# EAGLE design bridge (EAGLE 7.7.0)
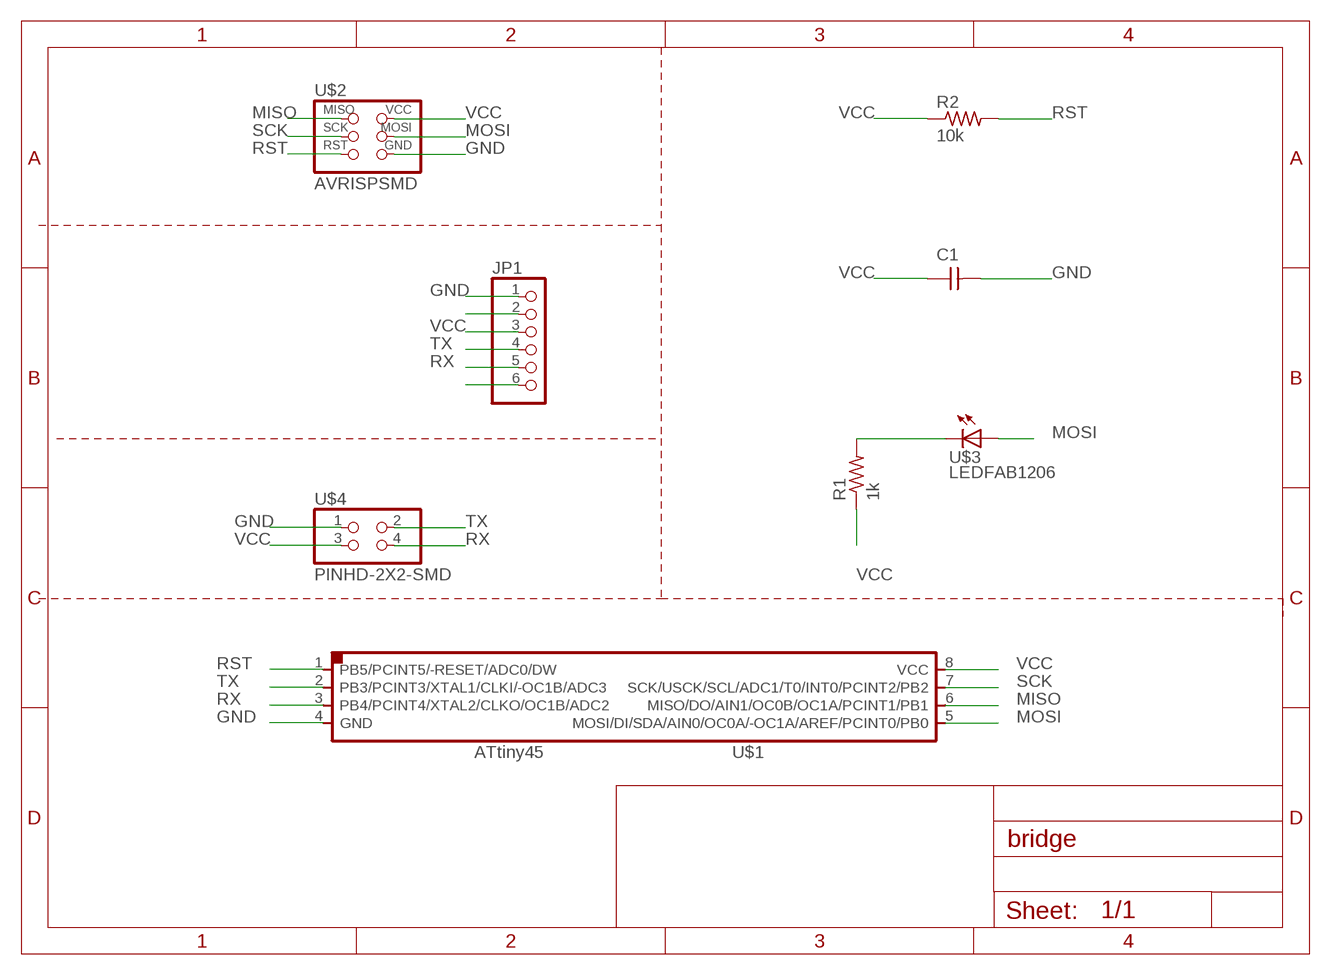
[diagram p0: schematic, sheet 1]

## Parts
C1  CAP-UNPOLARIZEDFAB  [C1206FAB]
JP1  PINHD-1X6  [1X06]
R1  1k  RES-US1206FAB  [R1206FAB]
R2  10k  RES-US1206FAB  [R1206FAB]
U$1  ATTINY45SI  [SOIC8]
U$2  AVRISPSMD  [2X03SMD]
U$3  LEDFAB1206  [LED1206FAB]
U$4  PINHD-2X2-SMD  [2X02SMD]

## Nets
GND: C1.2 JP1.1 U$1.4(GND) U$2.6(GND) U$4.1
MISO: U$1.6(MISO/DO/AIN1/OC0B/OC1A/PCINT1/PB1) U$2.1(MISO)
MOSI: U$1.5(MOSI/DI/SDA/AIN0/OC0A/-OC1A/AREF/PCINT0/PB0) U$2.4(MOSI) U$3.1(A)
N$1: R1.2 U$3.2(C)
N$3: JP1.2
N$7: JP1.6
RST: R2.2 U$1.1(PB5/PCINT5/-RESET/ADC0/DW) U$2.5(RST)
RX: JP1.5 U$1.3(PB4/PCINT4/XTAL2/CLKO/OC1B/ADC2) U$4.4
SCK: U$1.7(SCK/USCK/SCL/ADC1/T0/INT0/PCINT2/PB2) U$2.3(SCK)
TX: JP1.4 U$1.2(PB3/PCINT3/XTAL1/CLKI/-OC1B/ADC3) U$4.2
VCC: C1.1 JP1.3 R1.1 R2.1 U$1.8(VCC) U$2.2(VCC) U$4.3

## Library data of the parts
C1 = fab:CAP-UNPOLARIZED
JP1 = adafruit:PINHD-1X6: PIN HEADER
R1 R2 = fab:RES-US: Resistor (US Symbol) Variants with postfix FAB are widened to allow the routing of internal traces
U$1 = fab:ATTINY45
U$2 = fab:AVRISP
U$3 = fab:LED: LED
U$4 = fab:PINHD-2X2-SMD

## Board
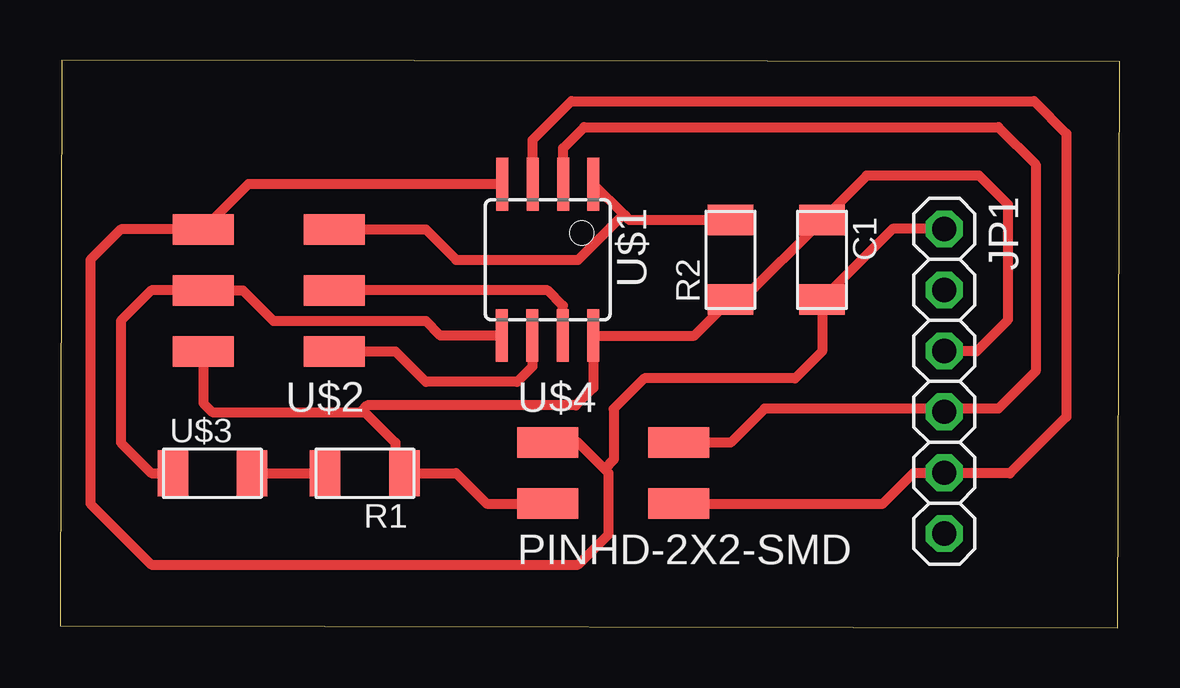
[diagram p1: board, top side]

Size 44.15 x 23.65 mm. Coordinates in mm from the lower left corner, seen from the top.
Outline: 0,0.08 44.07,0 44.15,23.57 0.08,23.65 0,0.08
Copper layers (1*16): Top 0.035mm / dielectric 1.5mm / Bottom 0.035mm
Design rules "default": minimum track width 10mil, minimum drill 24mil, track to track 8mil, track to pad 8mil, pad to pad 8mil, via to via 8mil, smd to smd 8mil, copper to edge 40mil, drill to drill 8mil, minimum pad ring 10mil, minimum via ring 8mil, stop-mask expansion 4mil, vias tented up to drill 0mil, thermal gap 10mil

### Footprints (pad centres in the part's own frame; a part is rotated, then mirrored left to right if it is on the bottom)
C1206FAB = smd 1.27 x 1.905: 1 -1.651,0; 2 1.651,0
1X06 = drill 1.016 octagon: 1 -6.35,0; 2 -3.81,0; 3 -1.27,0; 4 1.27,0; 5 3.81,0; 6 6.35,0
R1206FAB = smd 1.27 x 1.905: 1 -1.651,0; 2 1.651,0
SOIC8 = smd 0.5 x 2.2: 1 -1.905,-3.154; 2 -0.645,-3.154; 3 0.625,-3.154; 4 1.895,-3.154; 5 1.905,3.154; 6 0.635,3.154; 7 -0.635,3.154; 8 -1.905,3.154
2X03SMD = smd 2.54 x 1.27: 1 -2.54,2.54; 2 2.92,2.54; 3 -2.54,0; 4 2.92,0; 5 -2.54,-2.54; 6 2.92,-2.54
LED1206FAB = smd 1.27 x 1.905: 1 -1.651,0; 2 1.651,0
2X02SMD = smd 2.54 x 1.27: 1 -2.54,1.27; 2 2.92,1.27; 3 -2.54,-1.27; 4 2.92,-1.27

### Placement (x,y rotation side)
C1  31.75,15.32 270 top
JP1  36.84,10.26 270 top
R1  12.7,6.43 180 top
R2  27.94,15.32 90 top
U$1  20.32,15.32 180 top
U$2  8.89,14.05 180 top
U$3  6.35,6.43 0 top
U$4  22.86,6.43 0 top

### Tracks (layer width: path | path; a pad name or v marks a point on that pad's centre or on a via)
GND
  Top 0.406: 22.69,6.6 22.86,6.43 22.86,3.89 21.59,2.62 3.81,2.62 1.27,5.16 1.27,15.32 2.54,16.59 U$2.6 7.85,18.47 U$1.4 | 22.69,6.6 21.59,7.7 U$4.1 | 22.69,6.6 23.07,6.98 23.07,9.11 24.35,10.39 30.63,10.39 31.75,11.51 C1.2 34.69,16.61 JP1.1
MISO
  Top 0.406: U$2.1 13.97,11.51 15.24,10.24 19.05,10.24 19.68,10.88 U$1.6
MOSI
  Top 0.406: U$3.1 3.81,6.43 2.54,7.7 2.54,12.78 3.81,14.05 U$2.4 7.62,14.05 8.89,12.78 15.24,12.78 15.85,12.17 U$1.5
N$1
  Top 0.406: U$3.2 R1.2
RST
  Top 0.406: R2.2 23.73,16.97 23.48,17.21 | 23.48,17.21 U$1.1 | U$2.5 15.24,16.59 16.51,15.32 21.59,15.32 23.48,17.21
RX
  Top 0.406: U$4.4 34.29,5.16 35.56,6.43 35.57,6.42 36.96,6.42 | U$1.3 19.7,20.32 21.3,21.93 40.59,21.93 41.93,20.58 41.93,8.78 39.57,6.42 36.96,6.42 | JP1.5 36.93,6.45 36.96,6.42
SCK
  Top 0.406: U$1.7 20.95,13.42 20.32,14.05 U$2.3
TX
  Top 0.406: U$4.2 27.94,7.7 29.36,9.12 37.07,9.12 | U$1.2 20.96,19.98 21.84,20.85 39.1,20.85 40.65,19.3 40.65,10.67 39.1,9.12 37.07,9.12 | JP1.4 36.95,8.99 37.07,9.12
VCC
  Top 0.406: U$4.3 17.78,5.16 16.51,6.43 R1.1 13.97,6.81 13.97,7.7 12.7,8.97 12.52,8.97 | U$2.2 5.97,9.35 6.35,8.97 12.52,8.97 | 12.52,8.97 12.81,9.26 21.49,9.26 22.23,9.99 U$1.8 26.44,12.17 R2.1 28.45,13.67 C1.1 33.61,18.83 38.29,18.83 39.51,17.62 39.51,12.83 38.19,11.51 38.17,11.53 JP1.3